# EAGLE design TSat0-AvionicsPCB_v1.1 (EAGLE 9.7.0)
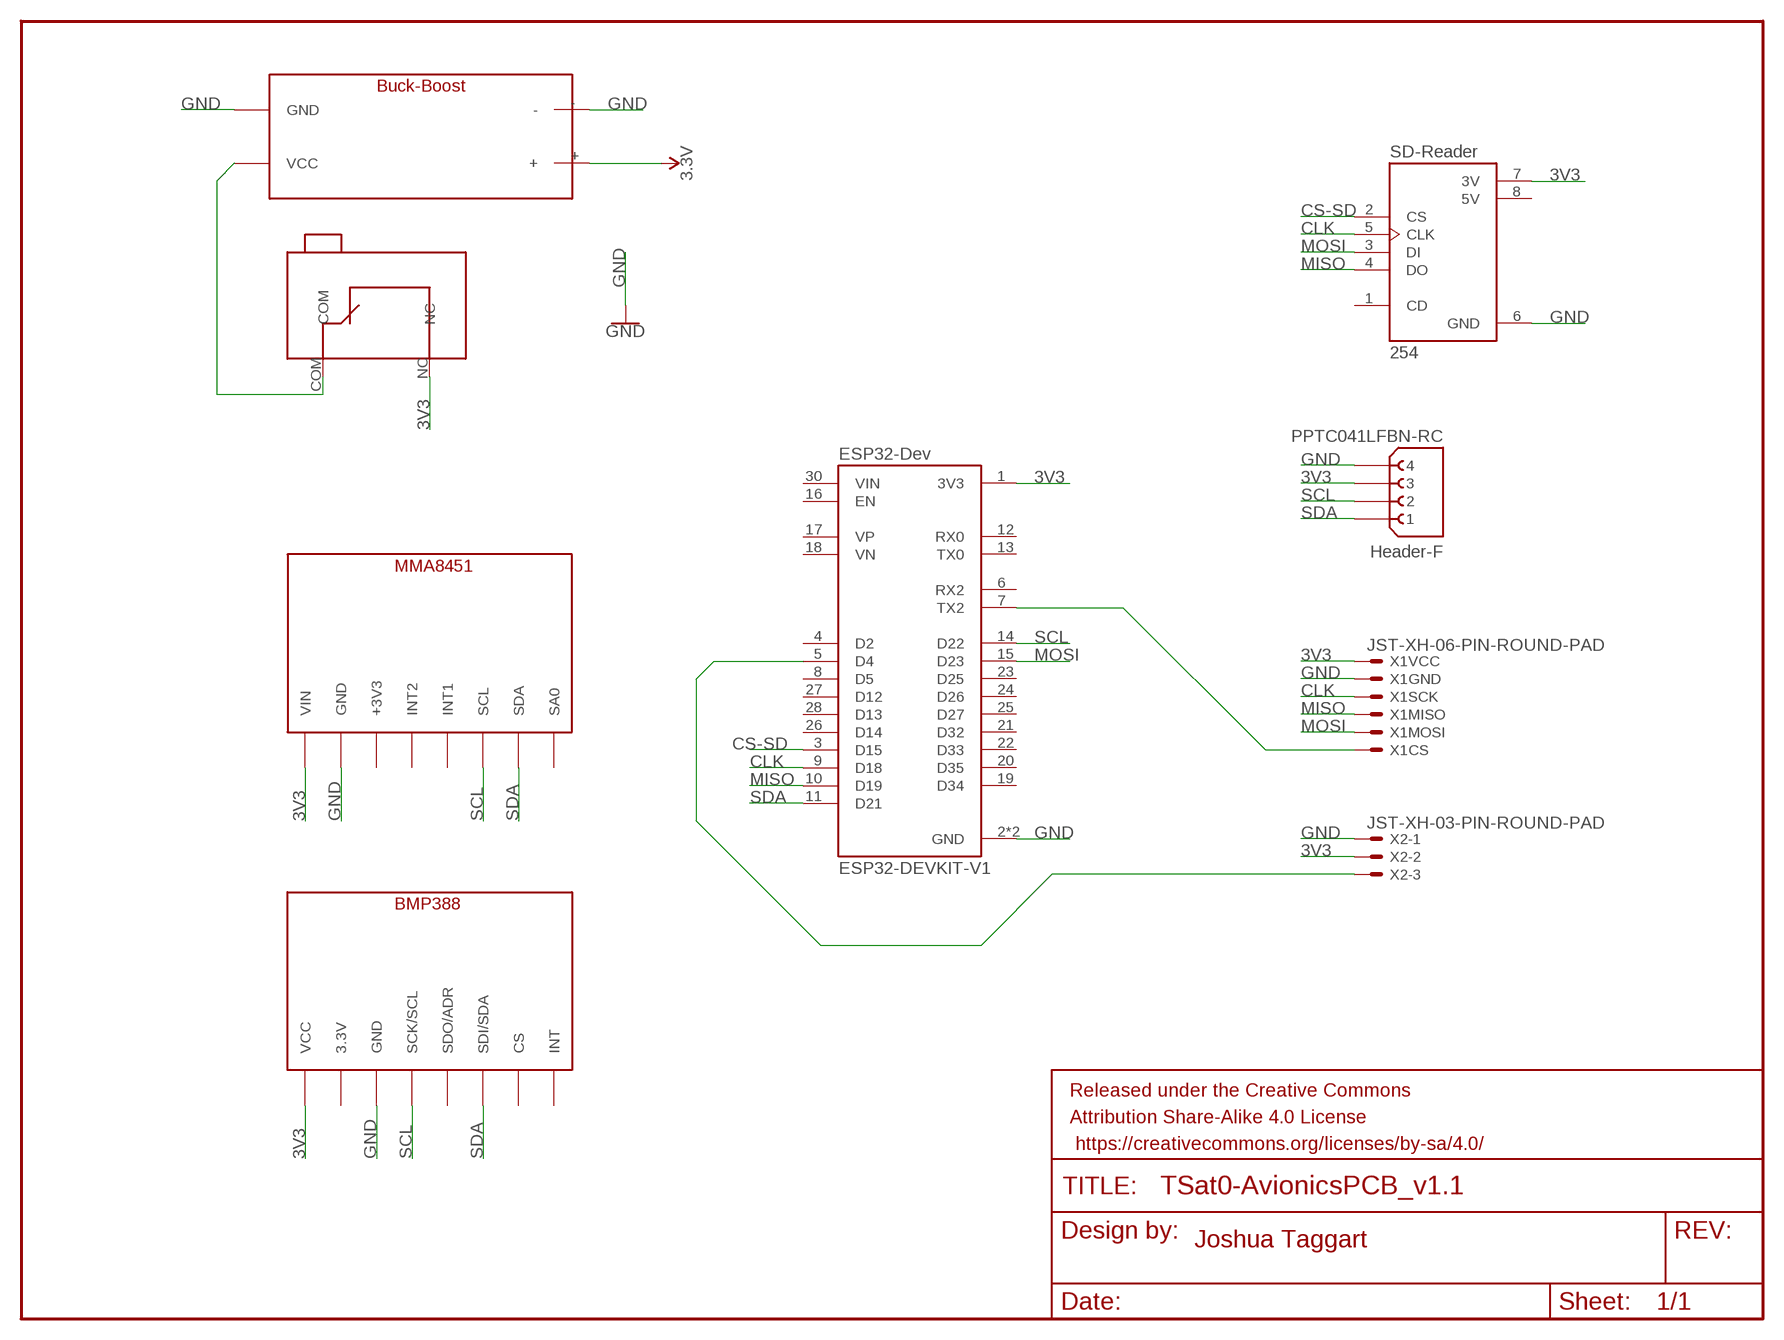
[diagram p0: schematic, sheet 1]

## Parts
BMP388  BMP388  [BMP388-FP]
FRAME1  FRAME-LETTERNO_PACKAGE  [DUMMY]
J1  PPTC041LFBN-RC  [SULLINS_PPTC041LFBN-RC]
MMA8451  MMA8451  [MMA8451-FP]
U1  ESP32-DEVKIT-V1  [MODULE_ESP32_DEVKIT_V1]
U2  254  [MODULE_254]
U$1  BUCKBOOST-LIPO  [BUCKBOOST-FP]
U$2  OMRON-MICROSWITCH  [OMRON-MICROSWITCH-FP]
X1  JST-XH-06-PIN-ROUND-PAD  [JST-XH-06-PACKAGE-ROUND-PAD]
X2  JST-XH-03-PIN-ROUND-PAD  [JST-XH-03-PACKAGE-ROUND-PAD]

## Nets
3.3V: U$1.+
3V3: BMP388.VCC J1.3 MMA8451.VIN U1.1(3V3) U2.7(3V) U$2.NC X1.VCC X2.2
CLK: U1.9(D18) U2.5(CLK) X1.SCK
CS-SD: U1.3(D15) U2.2(CS)
GND: BMP388.GND J1.4 MMA8451.GND U1.2(GND) U1.29(GND) U2.6(GND) U$1.- U$1.GND X1.GND X2.1
MISO: U1.10(D19) U2.4(DO) X1.MISO
MOSI: U1.15(D23) U2.3(DI) X1.MOSI
N$1: U1.7(TX2) X1.CS
N$2: U$1.VCC U$2.COM
N$3: U1.5(D4) X2.3
SCL: BMP388.SCK/SCL J1.2 MMA8451.SCL U1.14(D22)
SDA: BMP388.SDI/SDA J1.1 MMA8451.SDA U1.11(D21)
Unconnected: BMP388.3.3V BMP388.CS BMP388.INT BMP388.SDO/ADR MMA8451.+3V3 MMA8451.INT1 MMA8451.INT2 MMA8451.SA0 U1.4(D2) U1.6(RX2) U1.8(D5) U1.12(RX0) U1.13(TX0) U1.16(EN) U1.17(VP) U1.18(VN) U1.19(D34) U1.20(D35) U1.21(D32) U1.22(D33) U1.23(D25) U1.24(D26) U1.25(D27) U1.26(D14) U1.27(D12) U1.28(D13) U1.30(VIN) U2.1(CD)

## Notes on the sheet
- Joshua Taggart

## Power pins joined to a net without a drawn wire
5V: U2.8(5V)

## Library data of the parts
BMP388 = TSat0-Library:BMP388
FRAME1 = SparkFun-Aesthetics:FRAME-LETTER: Schematic Frame - Letter Standard 8.5x11 US Letter frame; DESIGNER: Nobody; VERSION: v01
J1 = TSat0-Library:PPTC041LFBN-RC: 4 Position Header Connector Through Hole Check availability <https://pricing.snapeda.com/parts/PPTC041LFBN-RC/Sullins%20Connector/view-part?ref=eda>; AVAILABILITY: In Stock; CHECK_PRICES: https://www.snapeda.com/parts/PPTC041LFBN-RC/Sullins+Connector+Solutions/view-part/?ref=eda; DESCRIPTION: 4 Position Header Connector 0.100 (2.54mm) Through Hole Tin; MF: Sullins Connector; MP: PPTC041LFBN-RC; PACKAGE: None; PRICE: None; SNAPEDA_LINK: https://www.snapeda.com/parts/PPTC041LFBN-RC/Sullins+Connector+Solutions/view-part/?ref=snap
MMA8451 = TSat0-Library:MMA8451
U1 = TSat0-Library:ESP32-DEVKIT-V1: Dual core, Wi-Fi: 2.4 GHz up to 150 Mbits/s,BLE (Bluetooth Low Energy) and legacy Bluetooth, 32 bits, Up to 240 MHz Check availability <https://pricing.snapeda.com/parts/ESP32-DEVKIT-V1/Do%20it/view-part?ref=eda>; AVAILABILITY: Not in stock; CHECK_PRICES: https://www.snapeda.com/parts/ESP32-DEVKIT-V1/Do+it/view-part/?ref=eda; DESCRIPTION: Dual core, Wi-Fi: 2.4 GHz up to 150 Mbits/s,BLE (Bluetooth Low Energy) and legacy Bluetooth, 32 bits, Up to 240 MHz; MF: Do it; MP: ESP32-DEVKIT-V1; PACKAGE: None; PRICE: None; SNAPEDA_LINK: https://www.snapeda.com/parts/ESP32-DEVKIT-V1/Do+it/view-part/?ref=snap
U2 = TSat0-Library:254: Check availability <https://pricing.snapeda.com/parts/254/Adafruit/view-part?ref=eda>; AVAILABILITY: In Stock; CHECK_PRICES: https://www.snapeda.com/parts/254/Adafruit+Industries/view-part/?ref=eda; DESCRIPTION: MicroSD card breakout board+ | Adafruit Industries 254; MF: Adafruit; MP: 254; PACKAGE: NON STANDARD Adafruit; PRICE: None; PURCHASE-URL: https://www.snapeda.com/api/url_track_click_mouser/?unipart_id=4653161&manufacturer=Adafruit&part_name=254&search_term=None; SNAPEDA_LINK: https://www.snapeda.com/parts/254/Adafruit+Industries/view-part/?ref=snap
U$1 = TSat0-Library:BUCKBOOST-LIPO
U$2 = TSat0-Library:OMRON-MICROSWITCH
X1 = TSat0-Library:JST-XH-06-PIN: JST XH Connector 2 Pin Wire to board connector. Pitch: 2,54 mm, (0.100") Number of pins: 6 Created by Rembrandt Electronics www.rembrandtelectronics.com
X2 = Rembrandt Electronics - JST XH Connectors v1-0:JST-XH-03-PIN: JST XH Connector 2 Pin Wire to board connector. Pitch: 2,54 mm, (0.100") Number of pins: 3 Created by Rembrandt Electronics www.rembrandtelectronics.com

## Net classes
0 default: width 0.254 mm

## Board
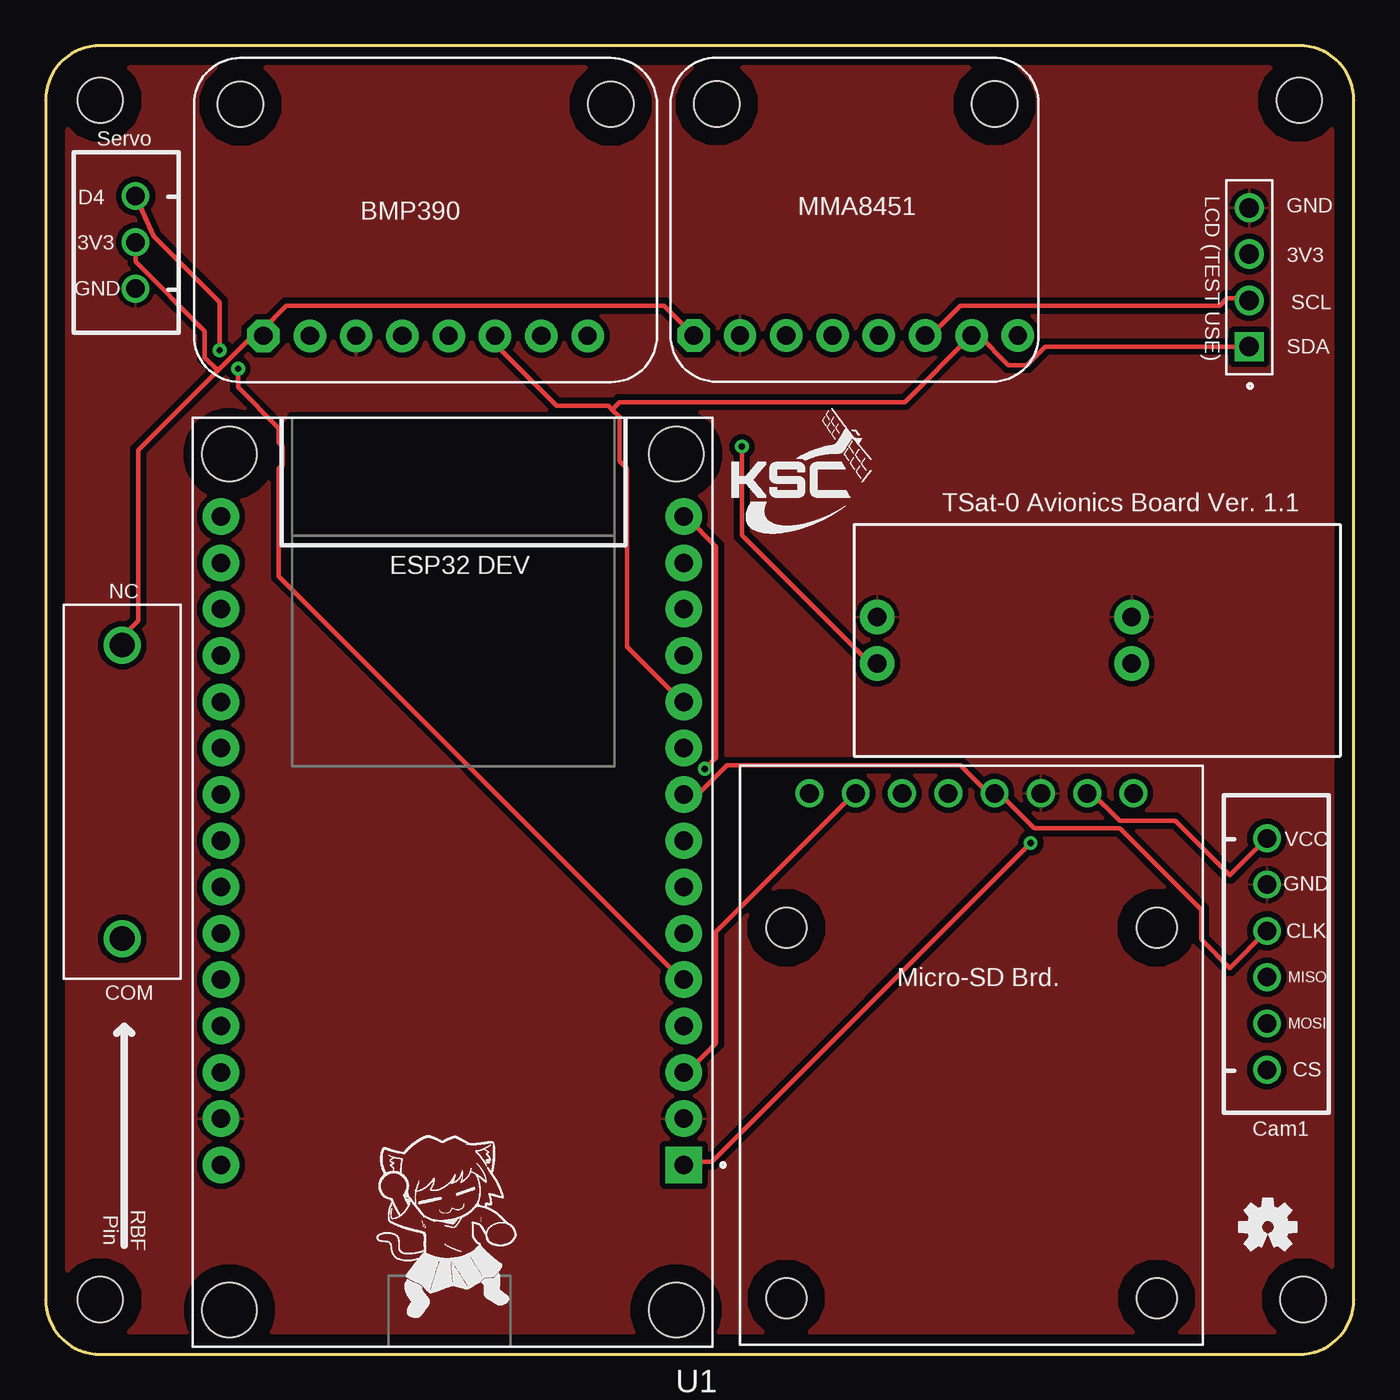
[diagram p1: board, top side]
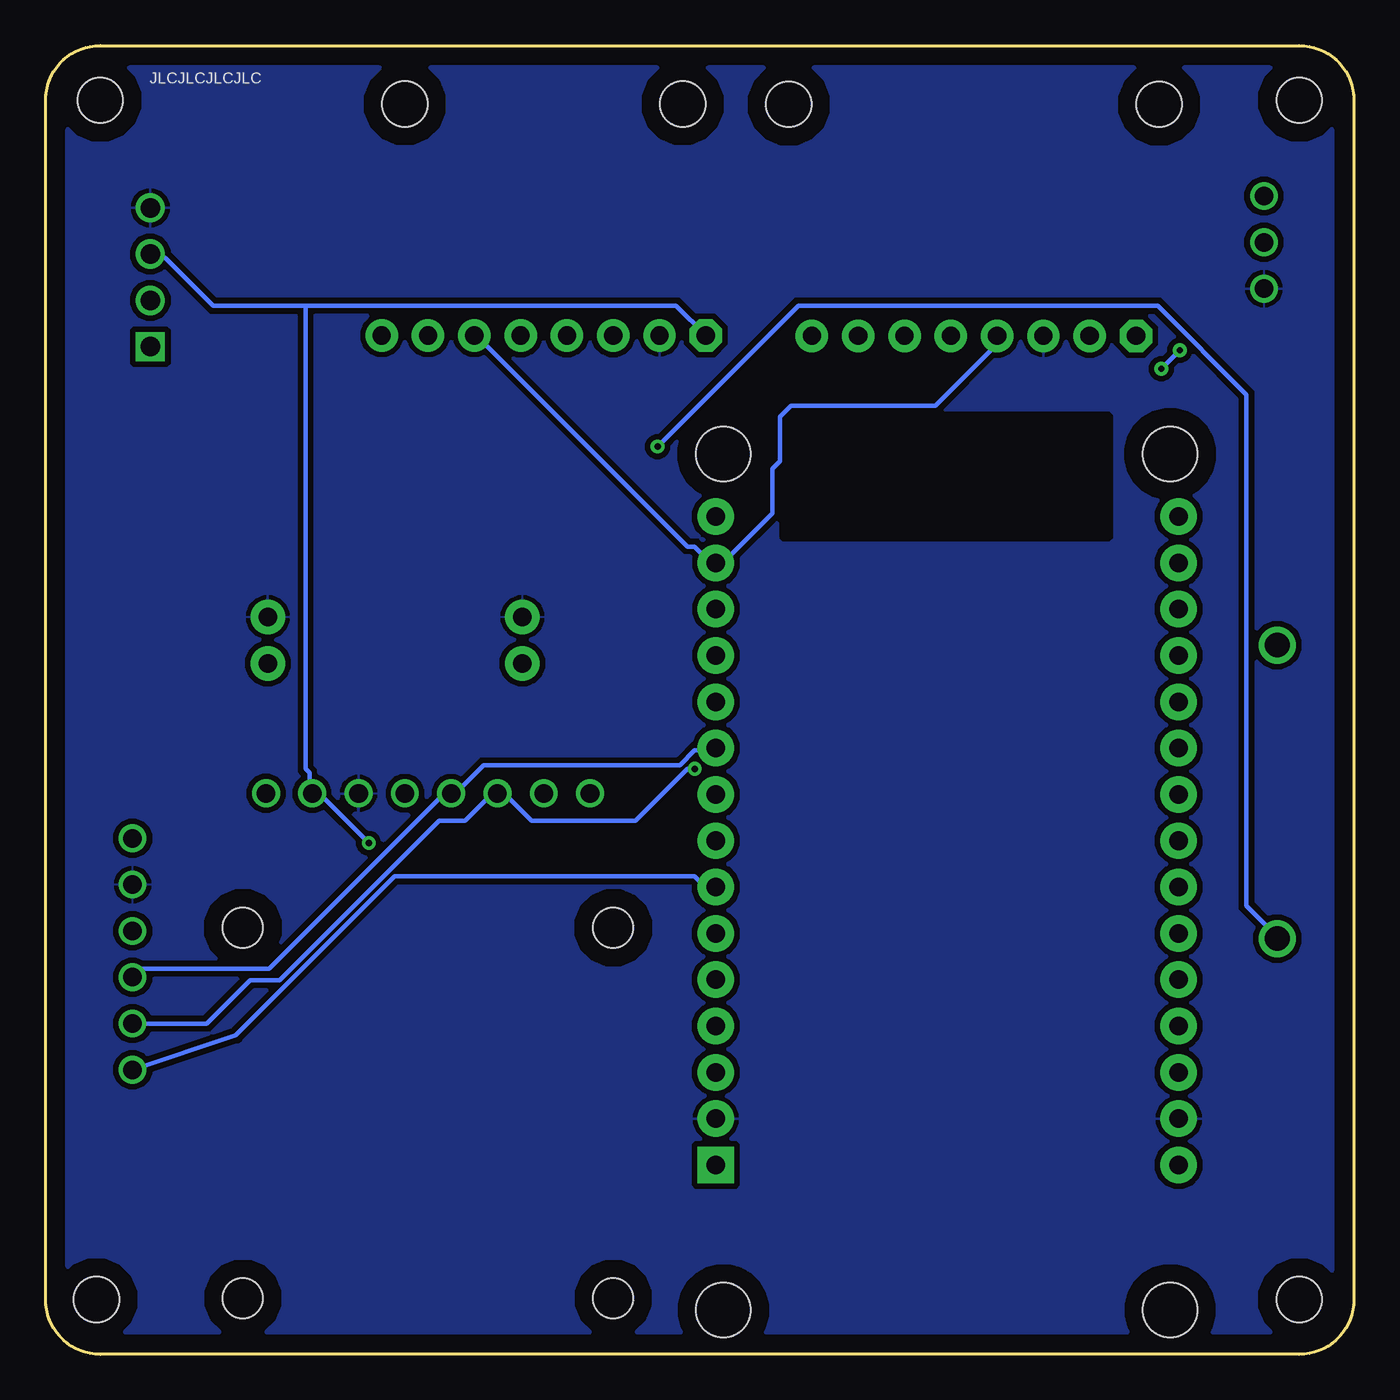
[diagram p2: board, bottom side, seen from below]

Size 71.78 x 71.78 mm. Coordinates in mm from the lower left corner, seen from the top.
Outline: 0,68.78 0,3 arc90 3,0 68.78,0 arc90 71.78,3 71.78,68.78 arc90 68.78,71.78 3,71.78 arc90 0,68.78
Copper layers (1*16): Top / Bottom
Stack-up Default Layer Stack: Top User Defined 0.035mm / Dielectric-1 User Defined 1.5mm / Bottom User Defined 0.035mm
Design rules: minimum copper width class=0 10mil, minimum copper width 6mil, minimum drill size 0.35mm, copper clearance wire_polygon to wire_polygon 6mil, copper clearance wire_polygon to pad_smd 6mil, copper clearance wire_polygon to via 6mil, copper clearance pad_smd to pad_smd 6mil, copper clearance pad_smd to via 6mil, copper clearance via to via 6mil, copper clearance smd to pad (same net) 6mil, copper clearance smd to via (same net) 6mil, copper clearance smd to smd (same net) 6mil, dimension clearance 40mil, restrict clearance 0mil, drill distance 6mil, keepout clearance 0mil
Holes 2.5 mm at 3,3 69,3 3,68.78 68.78,68.78

### Footprints (pad centres in the part's own frame; a part is rotated, then mirrored left to right if it is on the bottom)
BMP388-FP = drill 1 pad 1.778: 3.3V 6.35,2.54; CS 19.05,2.54; GND 8.89,2.54; INT 21.59,2.54; SCK/SCL 11.43,2.54; SDI/SDA 16.51,2.54; SDO/ADR 13.97,2.54 | drill 1 pad 1.778 octagon: VCC 3.81,2.54 | hole 2.5: 22.86,15.24; 2.54,15.24
SULLINS_PPTC041LFBN-RC = drill 1.07 square: 1 -3.81,0 | drill 1.07: 2 -1.27,0; 3 1.27,0; 4 3.81,0
MMA8451-FP = drill 1 pad 1.778: +3V3 6.35,2.54; GND 3.81,2.54; INT1 11.43,2.54; INT2 8.89,2.54; SA0 19.05,2.54; SCL 13.97,2.54; SDA 16.51,2.54 | drill 1 pad 1.778 octagon: VIN 1.27,2.54 | hole 2.5: 17.78,15.24; 2.54,15.24
MODULE_ESP32_DEVKIT_V1 = drill 1.02 pad 2 square: 1 -12.7,15.515 | drill 1.02 pad 2: 2 -12.7,12.975; 3 -12.7,10.435; 4 -12.7,7.895; 5 -12.7,5.355; 6 -12.7,2.815; 7 -12.7,0.275; 8 -12.7,-2.265; 9 -12.7,-4.805; 10 -12.7,-7.345; 11 -12.7,-9.885; 12 -12.7,-12.425; 13 -12.7,-14.965; 14 -12.7,-17.505; 15 -12.7,-20.045; 16 12.7,-20.045; 17 12.7,-17.505; 18 12.7,-14.965; 19 12.7,-12.425; 20 12.7,-9.885; 21 12.7,-7.345; 22 12.7,-4.805; 23 12.7,-2.265; 24 12.7,0.275; 25 12.7,2.815; 26 12.7,5.355; 27 12.7,7.895; 28 12.7,10.435; 29 12.7,12.975; 30 12.7,15.515 | hole 3: -12.28,-23.475; 12.23,-23.475; 12.23,23.475; -12.28,23.475
MODULE_254 = drill 1.02: 1 14.351,8.89; 2 14.351,6.35; 3 14.351,3.81; 4 14.351,1.27; 5 14.351,-1.27; 6 14.351,-3.81; 7 14.351,-6.35; 8 14.351,-8.89 | hole 2.2: -13.335,10.16; 6.985,10.16; 6.985,-10.16; -13.335,-10.16
BUCKBOOST-FP = drill 1.016 pad 1.88: + 15.24,5.08; - 15.24,7.62; GND 1.27,7.62; VCC 1.27,5.08
OMRON-MICROSWITCH-FP = drill 1.35: COM -16.1,0; NC 0,0
JST-XH-06-PACKAGE-ROUND-PAD = drill 1.016: CS 6.35,0; GND -3.81,0; MISO 1.27,0; MOSI 3.81,0; SCK -1.27,0; VCC -6.35,0
JST-XH-03-PACKAGE-ROUND-PAD = drill 1.016: 1 -2.54,0; 2 0,0; 3 2.54,0

### Placement (x,y rotation side)
BMP388  8.15,53.32 0 top
FRAME1  -49.53,92.71 0 top  (outside the outline)
J1  66.04,59.07 90 top
MMA8451  34.29,53.34 0 top
U1  22.31,25.9 180 top
U2  50.8,16.41 90 top
U$1  44.35,32.81 0 top
U$2  4.21,38.9 90 top
U$3  [OSHW-LOGO-S]  67.07,6.98 0 top
X1  67.01,21.95 270 top
X2  4.94,60.98 90 top

### Tracks (layer width: path | path; a pad name or v marks a point on that pad's centre or on a via)
3V3  (via drill 0.35)
  Top 0.254: X1.VCC 64.97,26.26 61.98,29.26 58.93,29.26 57.3,30.89 U2.7 | v54.05,28.04 36.58,10.57 35.15,10.57 U1.1 | 9.55,54.05 5.08,49.58 5.08,40.23 4.27,39.42 4.27,39.01 U$2.NC | 9.55,54.05 11.36,55.86 BMP388.VCC 11.96,56.26 13.21,57.51 33.93,57.51 MMA8451.VIN | 9.55,54.05 9.35,54.05 8.74,54.66 8.74,56.12 4.94,59.92 X2.2
  Bottom 0.254: v54.05,28.04 56.69,30.68 57.1,30.68 U2.7 57.3,30.89 57.3,31.9 57.51,32.11 57.51,57.51 | 57.51,57.51 37.19,57.51 MMA8451.VIN | 57.51,57.51 62.59,57.51 65.23,60.15 66.04,60.15 J1.3
CLK
  Top 0.254: X1.SCK 64.97,21.18 63.4,22.76 63.4,24.38 58.93,28.85 54.25,28.85 52.22,30.89 U2.5 52.02,30.89 51.61,30.89 50.19,32.31 37.39,32.31 35.97,30.89 35.15,30.89 U1.9
CS-SD
  Top 0.254: U2.2 44.3,30.68 36.78,23.16 36.78,17.07 35.15,15.44 U1.3
GND
  pour Top (isolate 0.305): 0,0 72,0 72,72 0,72
  pour Bottom (isolate 0.305): 0,0 72,0 72,72 0,72
MISO
  Bottom 0.254: U1.10 35.15,33.12 36.17,33.12 36.98,32.31 47.75,32.31 49.38,30.68 U2.4 49.58,30.68 49.99,30.68 59.52,21.15 66.54,21.15 X1.MISO
MOSI  (via drill 0.35)
  Top 0.254: v36.17,32.11 36.78,32.72 36.78,44.3 35.15,45.92 U1.15
  Bottom 0.254: v36.17,32.11 36.58,32.11 39.42,29.26 45.11,29.26 46.53,30.68 46.94,30.68 U2.3 47.14,30.89 48.77,29.26 50.19,29.26 58.93,20.52 60.55,20.52 62.94,18.14 X1.MOSI
N$1
  Bottom 0.254: X1.CS 61.36,17.48 52.63,26.21 36.17,26.21 35.76,25.81 35.15,25.81 U1.7
N$2  (via drill 0.35)
  Top 0.254: v38.2,49.78 38.2,44.91 45.11,38 45.52,38 U$1.VCC
  Bottom 0.254: v38.2,49.78 30.48,57.51 10.77,57.51 5.89,52.63 5.89,24.59 4.27,22.96 U$2.COM
N$3  (via drill 0.35)
  Top 0.254: v9.55,55.07 9.55,57.71 5.94,61.31 X2.3 | v10.57,54.05 10.57,53.03 12.8,50.8 12.8,49.99 13.01,49.78 13.01,48.77 12.8,48.56 12.8,42.67 34.95,20.52 U1.5
  Bottom 0.254: v10.57,54.05 v9.55,55.07
SCL
  Top 0.254: MMA8451.SCL 48.56,55.88 50.19,57.51 64.41,57.51 64.82,57.91 66.04,57.91 J1.2
  Bottom 0.254: BMP388.SCK/SCL 19.58,55.4 22.96,52.02 30.89,52.02 31.5,51.41 31.5,48.97 31.9,48.56 31.9,46.13 34.54,43.48 34.95,43.48 U1.14 35.15,43.28 36.17,44.3 36.58,44.3 48.16,55.88 MMA8451.SCL
SDA
  Top 0.254: J1.1 54.86,55.27 53.85,54.25 52.83,54.25 51.21,55.88 MMA8451.SDA 47.14,52.22 31.5,52.22 31.09,51.82 | 31.09,51.82 31.5,51.41 31.5,48.97 31.9,48.56 31.9,38.81 34.95,35.76 U1.11 | 31.09,51.82 30.89,52.02 28.04,52.02 24.66,55.4 BMP388.SDI/SDA

### Text on the board
SilkscreenTop: Servo | D4 | GND | BMP390 | MMA8451 | 3V3 | 3V3 | LCD (TEST USE) | GND | SCL | SDA | TSat-0 Avionics Board Ver. 1.1 | ESP32 DEV | NC | VCC | GND | CLK | Micro-SD Brd. | MISO | COM | MOSI | CS | Cam1 | Pin | RBF
SilkscreenBottom: JLCJLCJLCJLC